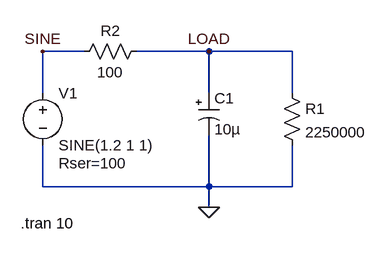
[diagram p0: schematic sine_on_C.asc]
sine_on_C.asc, the LTspice schematic file:
Version 4
SHEET 1 880 680
WIRE 112 64 48 64
WIRE 304 64 192 64
WIRE 432 64 304 64
WIRE 48 128 48 64
WIRE 304 128 304 64
WIRE 432 128 432 64
WIRE 48 272 48 208
WIRE 304 272 304 192
WIRE 304 272 48 272
WIRE 432 272 432 208
WIRE 432 272 304 272
WIRE 304 304 304 272
FLAG 304 304 0
FLAG 304 64 LOAD
FLAG 48 64 SINE
SYMBOL voltage 48 112 R0
WINDOW 123 0 0 Left 0
WINDOW 39 24 124 Left 2
SYMATTR InstName V1
SYMATTR Value SINE(1.2 1 1)
SYMATTR SpiceLine Rser=100
SYMBOL polcap 288 128 R0
WINDOW 3 24 56 Left 2
SYMATTR InstName C1
SYMATTR Value 10µ
SYMATTR Description Capacitor
SYMATTR Type cap
SYMATTR SpiceLine V=8 Irms=4.74342 Rser=0.01 Lser=0 mfg="KEMET" pn="A700X107M008ATE010" type="Al electrolytic"
SYMBOL res 416 112 R0
SYMATTR InstName R1
SYMATTR Value 2250000
SYMBOL res 208 48 R90
WINDOW 0 0 56 VBottom 2
WINDOW 3 32 56 VTop 2
SYMATTR InstName R2
SYMATTR Value 100
TEXT 14 328 Left 2 !.tran 10

The netlist it stands for:
* sine_on_C.asc
V1 SINE 0 SINE(1.2 1 1) Rser=100
C1 LOAD 0 10µ V=8 Irms=4.74342 Rser=0.01 Lser=0 mfg="KEMET" pn="A700X107M008ATE010" type="Al electrolytic"
R1 LOAD 0 2250000
R2 LOAD SINE 100
.tran 10
.backanno
.end